# EAGLE design SEED (EAGLE 7.4.0)
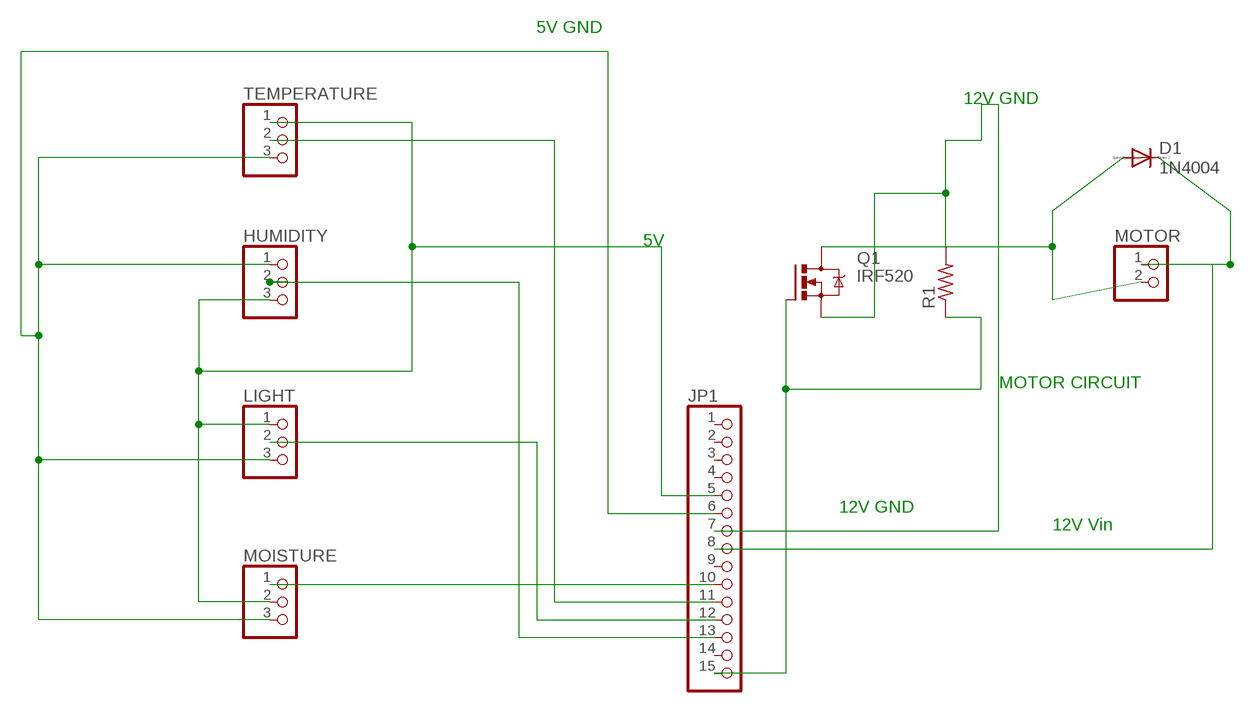
[diagram p0: schematic, sheet 1]

## Parts
D1  1N4004  [DO41-10]
HUMIDITY  PINHD-1X3  [1X03]
JP1  PINHD-1X15  [1X15]
LIGHT  PINHD-1X3  [1X03]
MOISTURE  PINHD-1X3  [1X03]
MOTOR  PINHD-1X2  [1X02]
Q1  IRF520  [TO220BV]
R1  R-US_0207/12  [0207/12]
TEMPERATURE  PINHD-1X3  [1X03]

## Nets
N$1: JP1.10 MOISTURE.1
N$2: JP1.11 TEMPERATURE.2
N$3: JP1.12 LIGHT.2
N$4: HUMIDITY.2 JP1.13
N$5: JP1.15 Q1.G R1.1
N$7: D1.A MOTOR.2 Q1.D
N$8: HUMIDITY.3 JP1.5 LIGHT.1 MOISTURE.2 TEMPERATURE.1
N$9: D1.C JP1.8 MOTOR.1
N$10: JP1.7 Q1.S R1.2
N$11: HUMIDITY.1 JP1.6 LIGHT.3 MOISTURE.3 TEMPERATURE.3
Unconnected: JP1.1 JP1.2 JP1.3 JP1.4 JP1.9 JP1.14

## Notes on the sheet
- 5V GND
- 12V GND
- 5V
- MOTOR CIRCUIT
- 12V GND
- 12V Vin

## Library data of the parts
D1 = diode:1N4004: DIODE general purpose rectifier, 1 A
HUMIDITY LIGHT MOISTURE TEMPERATURE = pinhead:PINHD-1X3: PIN HEADER
JP1 = pinhead:PINHD-1X15: PIN HEADER
MOTOR = pinhead:PINHD-1X2: PIN HEADER
Q1 = transistor-power:IRF520: HEXFET Power MOSFET
R1 = resistor:R-US_: RESISTOR, American symbol

## Board
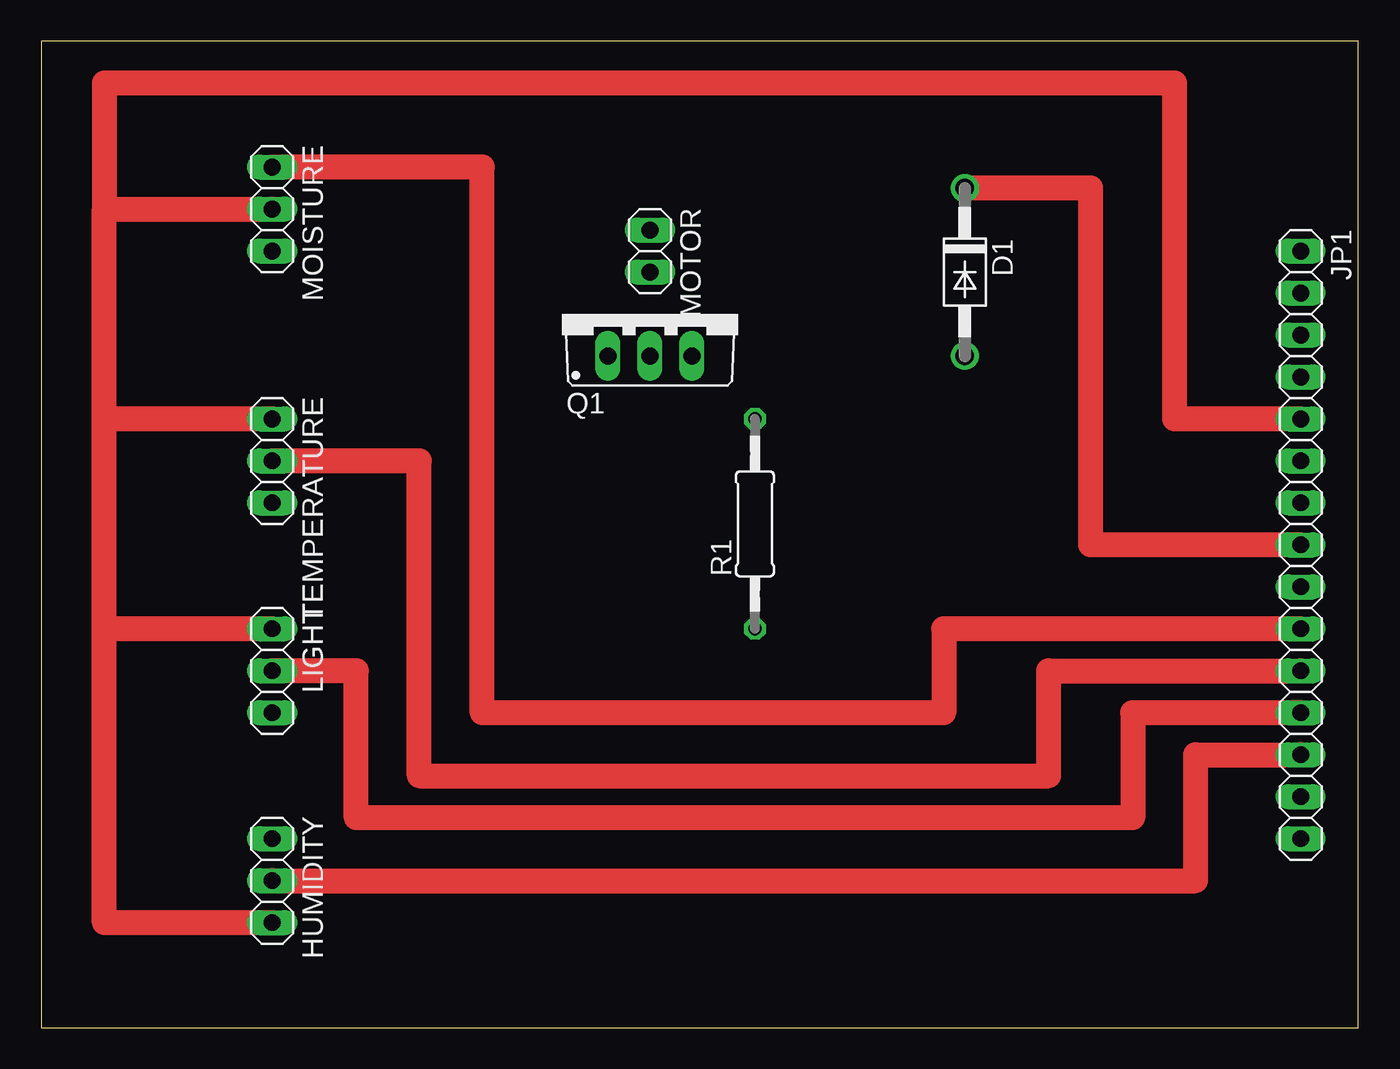
[diagram p1: board, top side]
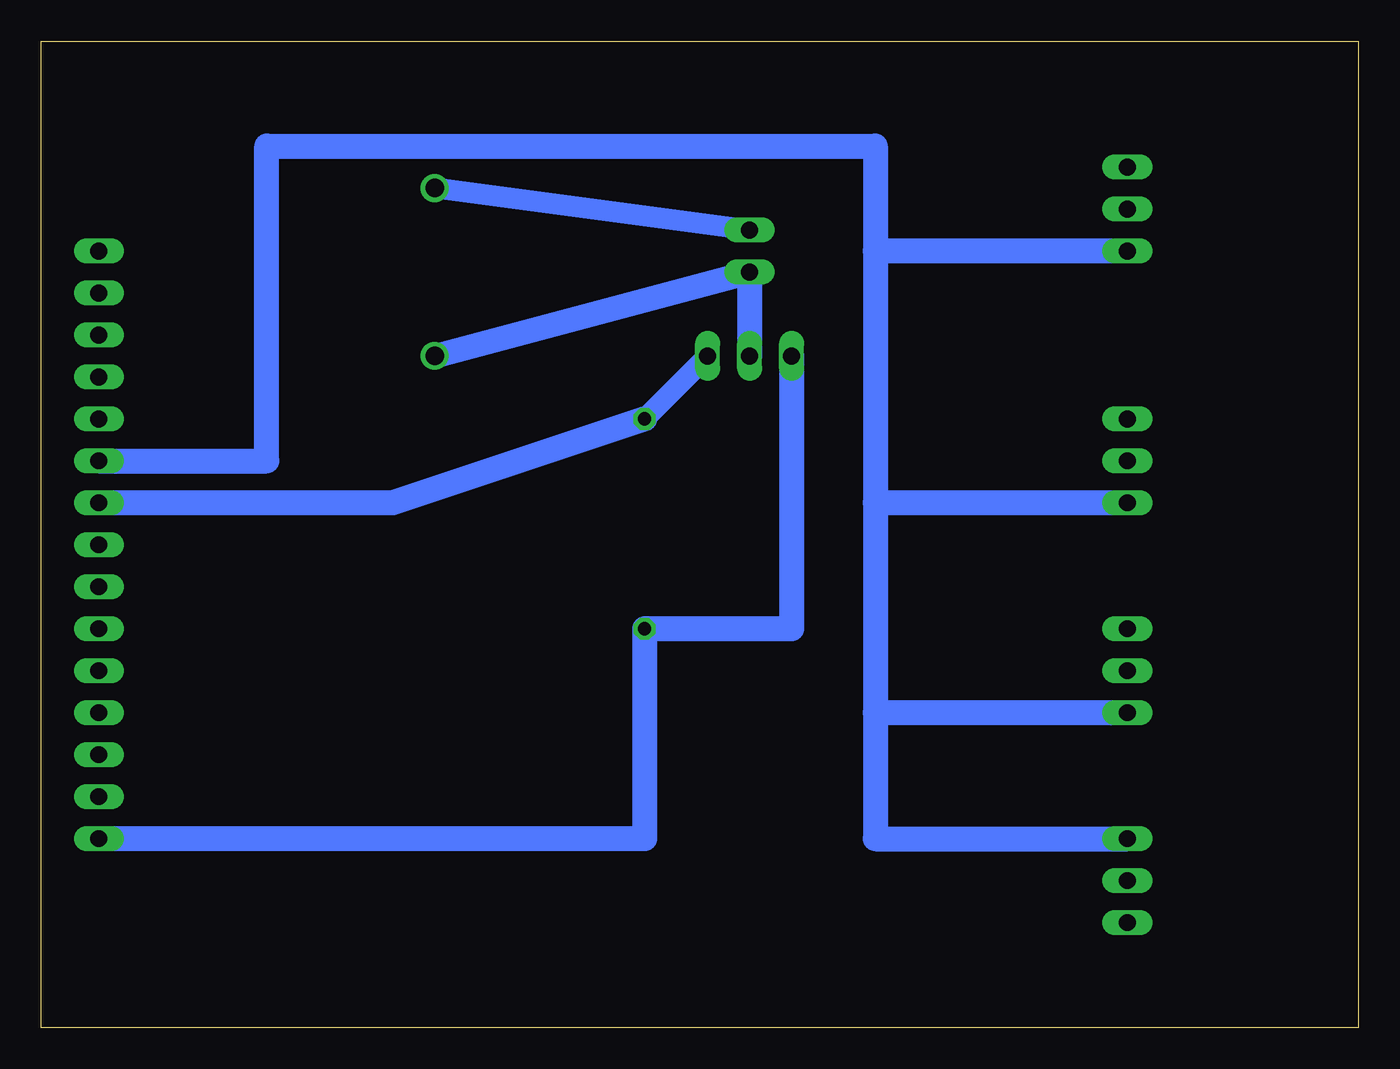
[diagram p2: board, bottom side, seen from below]

Size 79.68 x 59.68 mm. Coordinates in mm from the lower left corner, seen from the top.
Outline: 0,0 79.68,0 79.68,59.68 0,59.68 0,0
Copper layers (1*16): Top 0.035mm / dielectric 1.5mm / Bottom 0.035mm
Design rules "default": minimum track width 10mil, minimum drill 24mil, track to track 8mil, track to pad 8mil, pad to pad 8mil, via to via 8mil, smd to smd 8mil, copper to edge 40mil, drill to drill 8mil, minimum pad ring 10mil, minimum via ring 8mil, stop-mask expansion 4mil, vias tented up to drill 0mil, thermal gap 10mil

### Footprints (pad centres in the part's own frame; a part is rotated, then mirrored left to right if it is on the bottom)
DO41-10 = drill 1.118: A 5.08,0; C -5.08,0
1X03 = drill 1.016 long: 1 -2.54,0; 2 0,0; 3 2.54,0
1X15 = drill 1.016 long: 1 -17.78,0; 2 -15.24,0; 3 -12.7,0; 4 -10.16,0; 5 -7.62,0; 6 -5.08,0; 7 -2.54,0; 8 0,0; 9 2.54,0; 10 5.08,0; 11 7.62,0; 12 10.16,0; 13 12.7,0; 14 15.24,0; 15 17.78,0
1X02 = drill 1.016 long: 1 -1.27,0; 2 1.27,0
TO220BV = drill 1.016 long: D 0,-2.54; G -2.54,-2.54; S 2.54,-2.54
0207/12 = drill 0.813 octagon: 1 -6.35,0; 2 6.35,0

### Placement (x,y rotation side)
D1  55.88,45.72 270 top
HUMIDITY  13.97,8.89 270 top
JP1  76.2,29.21 270 top
LIGHT  13.97,21.59 270 top
MOISTURE  13.97,49.53 270 top
MOTOR  36.83,46.99 270 top
Q1  36.83,43.18 0 top
R1  43.18,30.48 90 top
TEMPERATURE  13.97,34.29 270 top

### Tracks (layer width: path | path; a pad name or v marks a point on that pad's centre or on a via)
N$1
  Top 1.524: JP1.10 54.61,24.13 54.61,19.05 26.67,19.05 26.67,52.07 MOISTURE.1
N$2
  Top 1.524: TEMPERATURE.2 22.86,34.29 22.86,15.24 60.96,15.24 60.96,21.59 JP1.11
N$3
  Top 1.524: JP1.12 66.04,19.05 66.04,12.7 19.05,12.7 19.05,21.59 LIGHT.2
N$4
  Top 1.524: HUMIDITY.2 69.85,8.89 69.85,16.51 JP1.13
N$5
  Bottom 1.524: JP1.15 43.18,11.43 R1.1 34.29,24.13 Q1.G
N$7
  Bottom 1.524: Q1.D MOTOR.2 D1.A
N$8
  Top 1.524: JP1.5 68.58,36.83 68.58,57.15 3.81,57.15 3.81,49.53 | 3.81,49.53 MOISTURE.2 | TEMPERATURE.1 3.81,36.83 | 3.81,36.83 3.81,49.53 | LIGHT.1 3.81,24.13 | 3.81,24.13 3.81,36.83 | HUMIDITY.3 3.81,6.35 3.81,24.13
N$9
  Top 1.524: JP1.8 63.5,29.21 63.5,50.8 D1.C
  Bottom 1.27: MOTOR.1 D1.C
N$10
  Bottom 1.27: Q1.S R1.2
  Bottom 1.524: R1.2 58.42,31.75 JP1.7
N$11
  Bottom 1.524: JP1.6 66.04,34.29 66.04,53.34 29.21,53.34 29.21,46.99 | 29.21,46.99 29.21,31.75 | 29.21,31.75 29.21,19.05 | 29.21,19.05 29.21,11.43 HUMIDITY.1 | LIGHT.3 29.21,19.05 | TEMPERATURE.3 29.21,31.75 | MOISTURE.3 29.21,46.99